# Altium project Khayyam_Board.PrjPcb
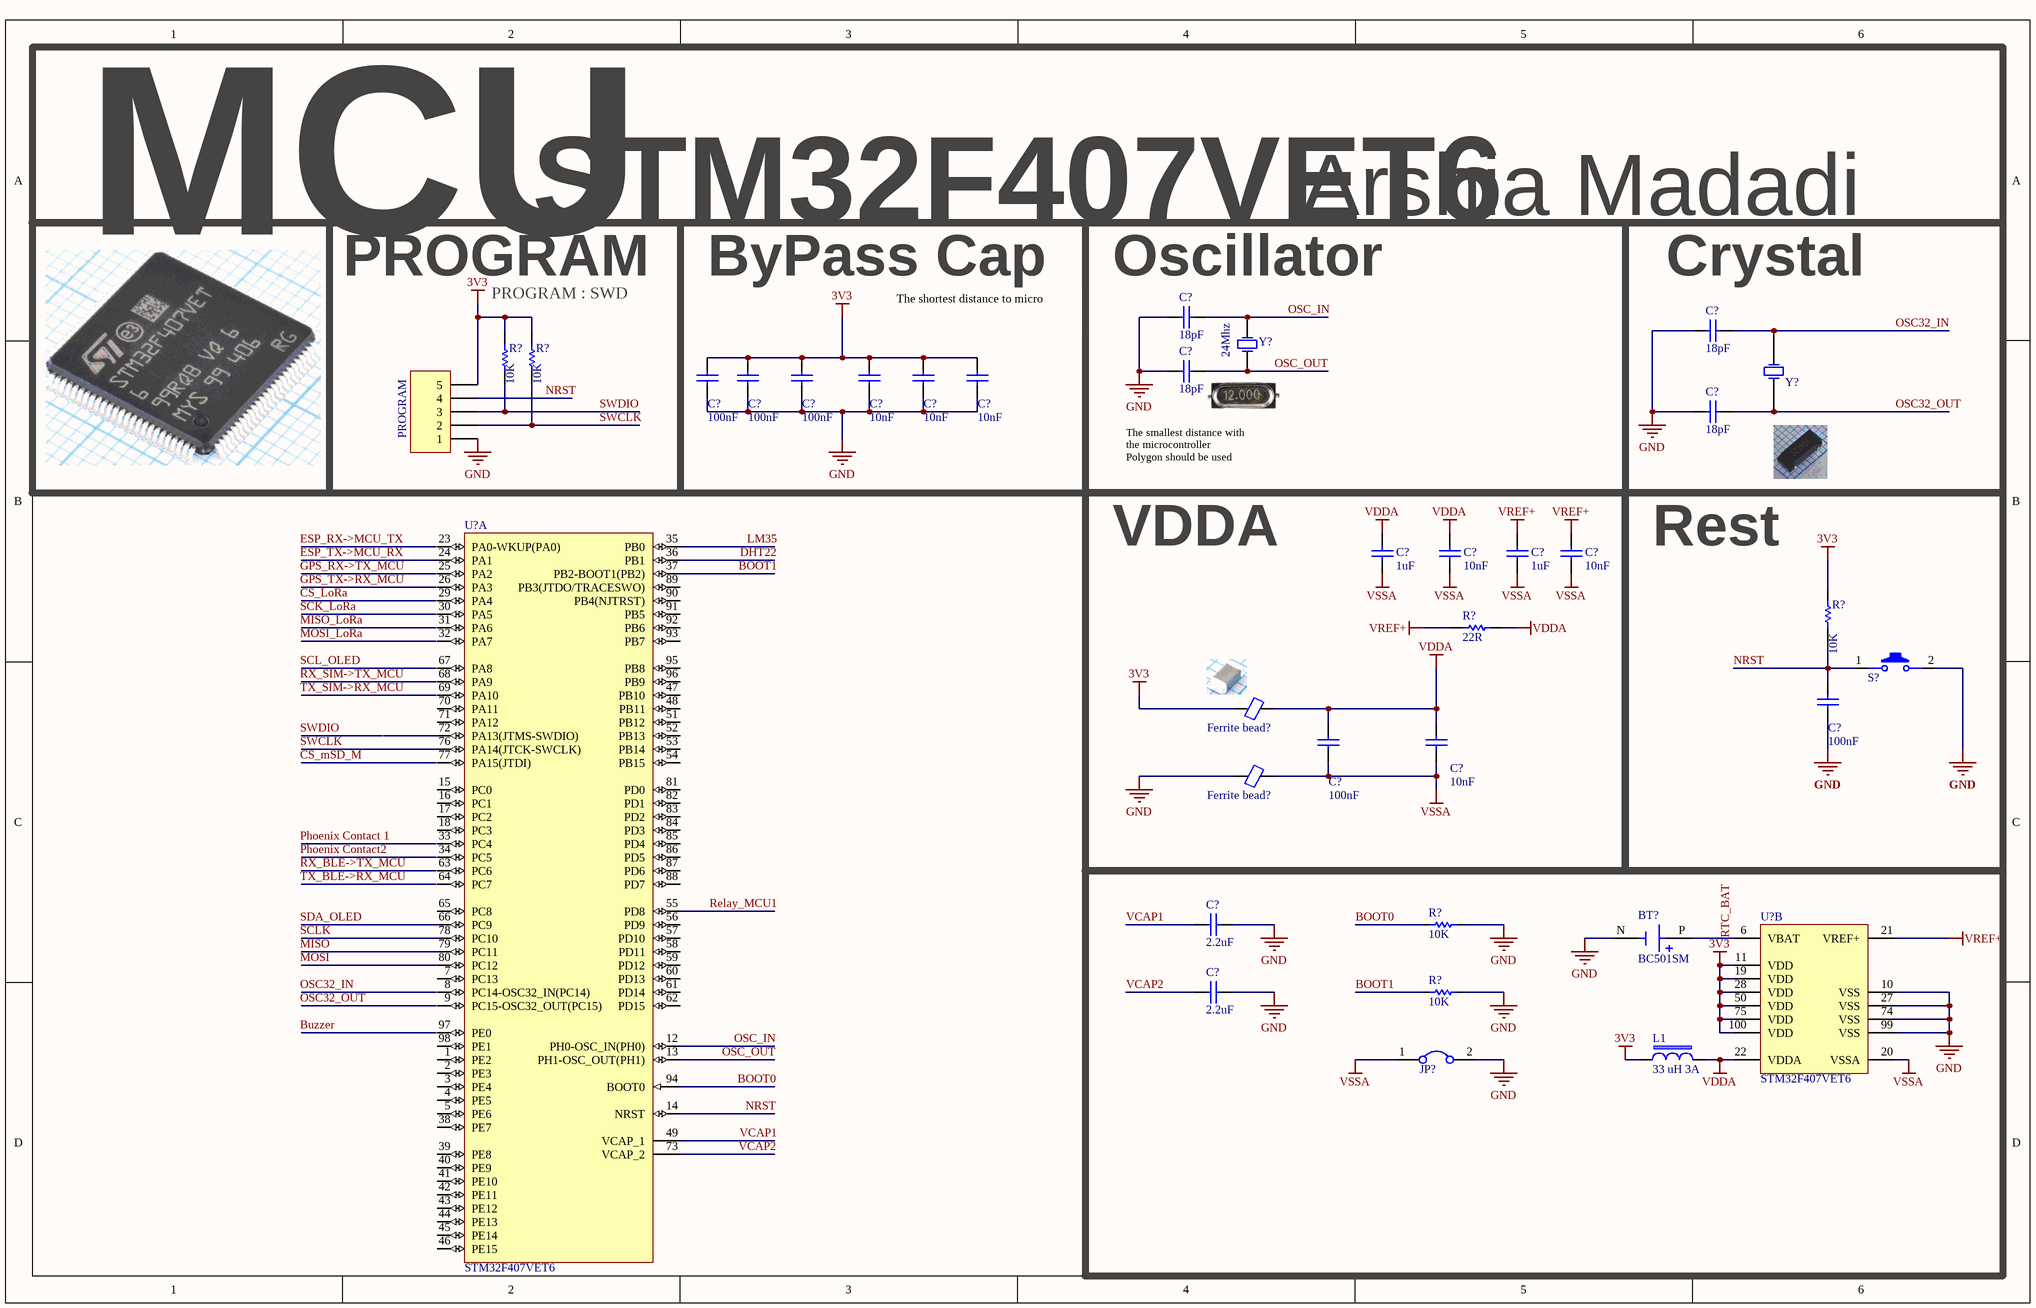
[diagram p0: MCU_stm32f407vet6.SchDoc]
5 sheets, 127 parts. Net scope: global (net labels, ports and power ports of the same name join across sheets).
Sheets:
  MCU_stm32f407vet6.SchDoc
  Power.SchDoc
  UI.SchDoc
  Communication.SchDoc
  Sensor.SchDoc

## Sheet MCU_stm32f407vet6.SchDoc
size 381 x 241 mm; SheetNumber: 1; SheetTotal: 5

### Parts
(Parts that share a designator on the sheet are numbered #1, #2 ... from top to bottom, then left to right.)
BT?  BC501SM  [BAT_BC501SM]
C?#1  18pF  [MY_CAP_SMD_0603]
C?#2  18pF  [MY_CAP_SMD_0603]
C?#3  18pF  [MY_CAP_SMD_0603]
C?#4  100nF  [MY_CAP_SMD_0603]
C?#5  100nF  [MY_CAP_SMD_0603]
C?#6  100nF  [MY_CAP_SMD_0603]
C?#7  10nF  [MY_CAP_SMD_0603]
C?#8  10nF  [MY_CAP_SMD_0603]
C?#9  10nF  [MY_CAP_SMD_0603]
C?#10  18pF  [MY_CAP_SMD_0603]
C?#11  1uF  [MY_CAP_SMD_0603]
C?#12  10nF  [MY_CAP_SMD_0603]
C?#13  1uF  [MY_CAP_SMD_0603]
C?#14  10nF  [MY_CAP_SMD_0603]
C?#15  100nF  [MY_CAP_SMD_0603]
C?#16  100nF  [MY_CAP_SMD_0603]
C?#17  10nF  [MY_CAP_SMD_0603]
C?#18  2.2uF  [MY_CAP_SMD_0603]
C?#19  2.2uF  [MY_CAP_SMD_0603]
Ferrite_bead?#1  Ferrite Bead SMD  [FB1206]  (value not drawn)
Ferrite_bead?#2  Ferrite Bead SMD  [FB1206]  (value not drawn)
JP?#1  Jumper  [Jumper Small - 2.54 - GRAY]  (value not drawn)
L1  33 uH 3A  [10UH]
PROGRAM  Header 5  [My_1X05]  (value not drawn)
R?#1  10K  [RESC3413X04N]
R?#2  10K  [RESC3413X04N]
R?#3  10K  [RESC3413X04N]
R?#4  22R  [RESC3413X04N]
R?#5  10K  [0805]
R?#6  10K  [0805]
S?#1  SW_PB2  [SMD_ALPS_SKQMBBE010]  (value not drawn)
U?#1  STM32F407VET6  [STM-LQFP100_N]  (part A of 2)
U?#2  STM32F407VET6  [STM-LQFP100_N]  (part B of 2)
Y?#1  24Mhz  [Crystal]
Y?#2  11.0592 MHz  [XTAL RTC - V]  (value not drawn)

### Blocks framed on the sheet
MCU: C?#1-C?#10 PROGRAM R?#1 R?#2 Y?#1 Y?#2
VDDA: C?#11-C?#14 C?#16 C?#17 Ferrite_bead?#1 Ferrite_bead?#2 R?#4
Rest: C?#15 R?#3 S?#1

### Nets
3V3: C?#4.1 C?#5.1 C?#6.1 C?#7.1 C?#8.1 C?#9.1 Ferrite_bead?#1.1 L1.2 PROGRAM.5 R?#1.2 R?#2.2 R?#3.2 U?#2.11(VDD) U?#2.19(VDD) U?#2.28(VDD) U?#2.50(VDD) U?#2.75(VDD) U?#2.100(VDD)
GND: BT?.N(NEG) C?#1.1 C?#2.1 C?#3.1 C?#4.2 C?#5.2 C?#6.2 C?#7.2 C?#8.2 C?#9.2 C?#10.1 C?#15.2 C?#18.2 C?#19.2 Ferrite_bead?#2.1 JP?#1.2 PROGRAM.1 R?#5.2 R?#6.2 S?#1.2 U?#2.10(VSS) U?#2.27(VSS) U?#2.74(VSS) U?#2.99(VSS)
VDDA: C?#11.1 C?#12.1 C?#16.1 C?#17.1 Ferrite_bead?#1.2 L1.1 R?#4.2 U?#2.22(VDDA)
VREF+: C?#13.1 C?#14.1 R?#4.1 U?#2.21(VREF+)
VSSA: C?#11.2 C?#12.2 C?#13.2 C?#14.2 C?#16.2 C?#17.2 Ferrite_bead?#2.2 JP?#1.1 U?#2.20(VSSA)
BOOT0: R?#5.1 U?#1.94(BOOT0)
BOOT1: R?#6.1 U?#1.37(PB2-BOOT1(PB2))
DHT22: U?#1.36(PB1)
LM35: U?#1.35(PB0)
NRST: C?#15.1 PROGRAM.4 R?#3.1 S?#1.1(Button) U?#1.14(NRST)
OSC32_IN: C?#2.2 Y?#2.2(OSC2)
OSC32_OUT: C?#10.2 Y?#2.1(OSC1)
OSC_IN: C?#1.2 U?#1.12(PH0-OSC_IN(PH0)) Y?#1.2(OSC2)
OSC_OUT: C?#3.2 U?#1.13(PH1-OSC_OUT(PH1)) Y?#1.1(OSC1)
Relay_MCU1: U?#1.55(PD8)
RTC_BAT: BT?.P(POS) U?#2.6(VBAT)
SWCLK: PROGRAM.2 R?#2.1
SWDIO: PROGRAM.3 R?#1.1
VCAP1: C?#18.1 U?#1.49(VCAP_1)
VCAP2: C?#19.1 U?#1.73(VCAP_2)

Not connected (* = marked no-connect by the designer): U?#1 1(PE2) 2(PE3) 3(PE4) 4(PE5) 5(PE6) 7(PC13) 8(PC14-OSC32_IN(PC14)) 9(PC15-OSC32_OUT(PC15)) 15(PC0) 16(PC1) 17(PC2) 18(PC3) 23(PA0-WKUP(PA0)) 24(PA1) 25(PA2) 26(PA3) 29(PA4) 30(PA5) 31(PA6) 32(PA7) 33(PC4) 34(PC5) 38(PE7) 39(PE8) 40(PE9) 41(PE10) 42(PE11) 43(PE12) 44(PE13) 45(PE14) 46(PE15) 47(PB10) 48(PB11) 51(PB12) 52(PB13) 53(PB14) 54(PB15) 56(PD9) 57(PD10) 58(PD11) 59(PD12) 60(PD13) 61(PD14) 62(PD15) 63(PC6) 64(PC7) 65(PC8) 66(PC9) 67(PA8) 68(PA9) 69(PA10) 70(PA11) 71(PA12) 72(PA13(JTMS-SWDIO)) 76(PA14(JTCK-SWCLK)) 77(PA15(JTDI)) 78(PC10) 79(PC11) 80(PC12) 81(PD0) 82(PD1) 83(PD2) 84(PD3) 85(PD4) 86(PD5) 87(PD6) 88(PD7) 89(PB3(JTDO/TRACESWO)) 90(PB4(NJTRST)) 91(PB5) 92(PB6) 93(PB7) 95(PB8) 96(PB9) 97(PE0) 98(PE1)

### Notes on the sheet
- STM32F407VET6
- Arshia Madadi
- PROGRAM
- (near R?#2) PROGRAM : SWD
- ByPass Cap
- (near C?#1) Oscillator
- (near C?#2) Crystal
- (near C?#8) The shortest distance to micro
- The smallest distance with the microcontroller
  Polygon should be used
- Labels drawn without touching a wire or pin: Buzzer, CS_LoRa, CS_mSD_M, ESP_RX->MCU_TX, ESP_TX->MCU_RX, GPS_RX->TX_MCU, GPS_TX->RX_MCU, MISO, MISO_LoRa, MOSI, MOSI_LoRa, OSC32_IN, OSC32_OUT, Phoenix Contact2, Phoenix Contact 1, RX_BLE->TX_MCU, RX_SIM->TX_MCU, SCK_LoRa, SCL_OLED, SCLK, SDA_OLED, SWCLK, SWDIO, TX_BLE->RX_MCU, TX_SIM->RX_MCU

### Library data of the parts
BT? = BC501SM: BATTERY HOLDER COIN 12MM SMD; MF: MPD; SnapEDA_Link: https://www.snapeda.com/parts/BC501SM/MPD/view-part/?ref=snap; Package: None; MP: BC501SM; Price: None; Availability: Unavailable; Check_prices: https://www.snapeda.com/parts/BC501SM/MPD/view-part/?ref=eda; Value: *
C?#1-C?#19 = CAP SMD_0603
Ferrite_bead?#1 Ferrite_bead?#2 = Ferrite Bead SMD Package: Designer: Ali Hafizi
JP?#1 = Jumper: Company: E.P.I.L; Defualt State: Close; Design Date: 2011/11/02
L1 = Inductor_B: Inductor; Code_IEC: 1005; Published: 8-Jun-2000; LatestRevisionDate: 17-Jul-2002; LatestRevisionNote: Re-released for DXP Platform.; PackageReference: 0402-A; Publisher: Altium Limited; Code_JEITA: 0402
PROGRAM = Header 5: Header, 5-Pin; LatestRevisionDate: 17-Jul-2002; LatestRevisionNote: Re-released for DXP Platform.; Publisher: Altium Limited
R?#1-R?#4 = RES 0805 0.125W: RES 0805; Designer: Abbas Basereh; Desc.: RES SMD 0805; Data: 16-12-2016
R?#5 R?#6 = Res: Resistor; Published: 8-Jun-2000; LatestRevisionDate: 17-Jul-2002; LatestRevisionNote: Re-released for DXP Platform.; PackageReference: AXIAL-0.3; Publisher: Altium Limited
S?#1 = SW_PB2: 2 Pin Push Button Switch; Company: SJ Libraries; Designer: Eng. Saeid Jorablo; Mounting Technology: Surface Mount\Through-Hole; ComponentLink1Description: Datasheet; Pin Count: 0; Update Date: 6/3/2012; Category: MISC; HelpURL: http://s3.picofile.com/file/7443264187/Coming_Soon_logo.gif
U?#1 U?#2 = STM32F407VET6: ARM Cortex-M4 32-bit MCU+FPU, 210 DMIPS, 512 kB Flash, 192 kB Internal RAM, 82 I/Os, 100-pin LQFP, -40 to 85 degC, Tray; Manufacturer: STMicroelectronics; D/A Converter: 2x12-bit; FLASH Size (Prog) (kB): 512; I/Os (High Current): 82; Internal RAM Size (kB): 192; Operating Frequency(F) (Processor speed) (MHz): 168; Supply Voltage(Vcc) max (V): 3.6; Supply Voltage(Vcc) min (V): 1.8; DatasheetVersion: Rev. 4; PackageVersion: Rev. 1, 06/2013; PackageReference: LQFP100; PackageDescription: 100-Pin Low Profile Quad Flat Package, 14 x 14 mm Body, 0.5 mm Pitch; Supplier 1: Digi-Key; Supplier Part Number 1: 497-12075-ND; Supplier 2: Farnell; Supplier Part Number 2: 2064367; Supplier 3: Newark; Supplier Part Number 3: 73T2332; Supplier 4: Mouser; Supplier Part Number 4: 511-STM32F407VET6; Core: ARM Cortex-M4; Packing: Tray; Mounting Technology: Surface Mount; PartNumber: STM32F407VET6; ComponentLink1Description: Manufacturer URL; ComponentLink1URL: http://www.st.com/web/en/home.html; ComponentLink2Description: Datasheet; ComponentLink2URL: http://www.st.com/st-web-ui/static/active/en/resource/technical/document/datasheet/DM00037051.pdf; ComponentLink3Description: Package Specification; ComponentLink3URL: http://www.st.com/st-web-ui/static/active/en/resource/technical/document/data_brief/DM00071938.pdf
Y?#1 = XTAL: Crystal Oscillator; Published: 8-Jun-2000; LatestRevisionDate: 17-Jul-2002; LatestRevisionNote: Re-released for DXP Platform.; PackageReference: R38; Publisher: Altium Limited
Y?#2 = XTAL_Crystal: XTAL Crystal; Company: SJ Libraries; Designer: Eng. Saeid Jorablo; Design Date: 11/04/2011; ComponentLink1Description: Datasheet; ComponentLink2Description: Reference; Publisher: SJ Unlimited; Mounting Technology: Surface Mount\Through-Hole; Value: 11.0592 MHz; HelpURL: http://s3.picofile.com/file/7443264187/Coming_Soon_logo.gif; Status: Unreleased

## Sheet Power.SchDoc
size 381 x 241 mm; SheetNumber: 1; SheetTotal: 5
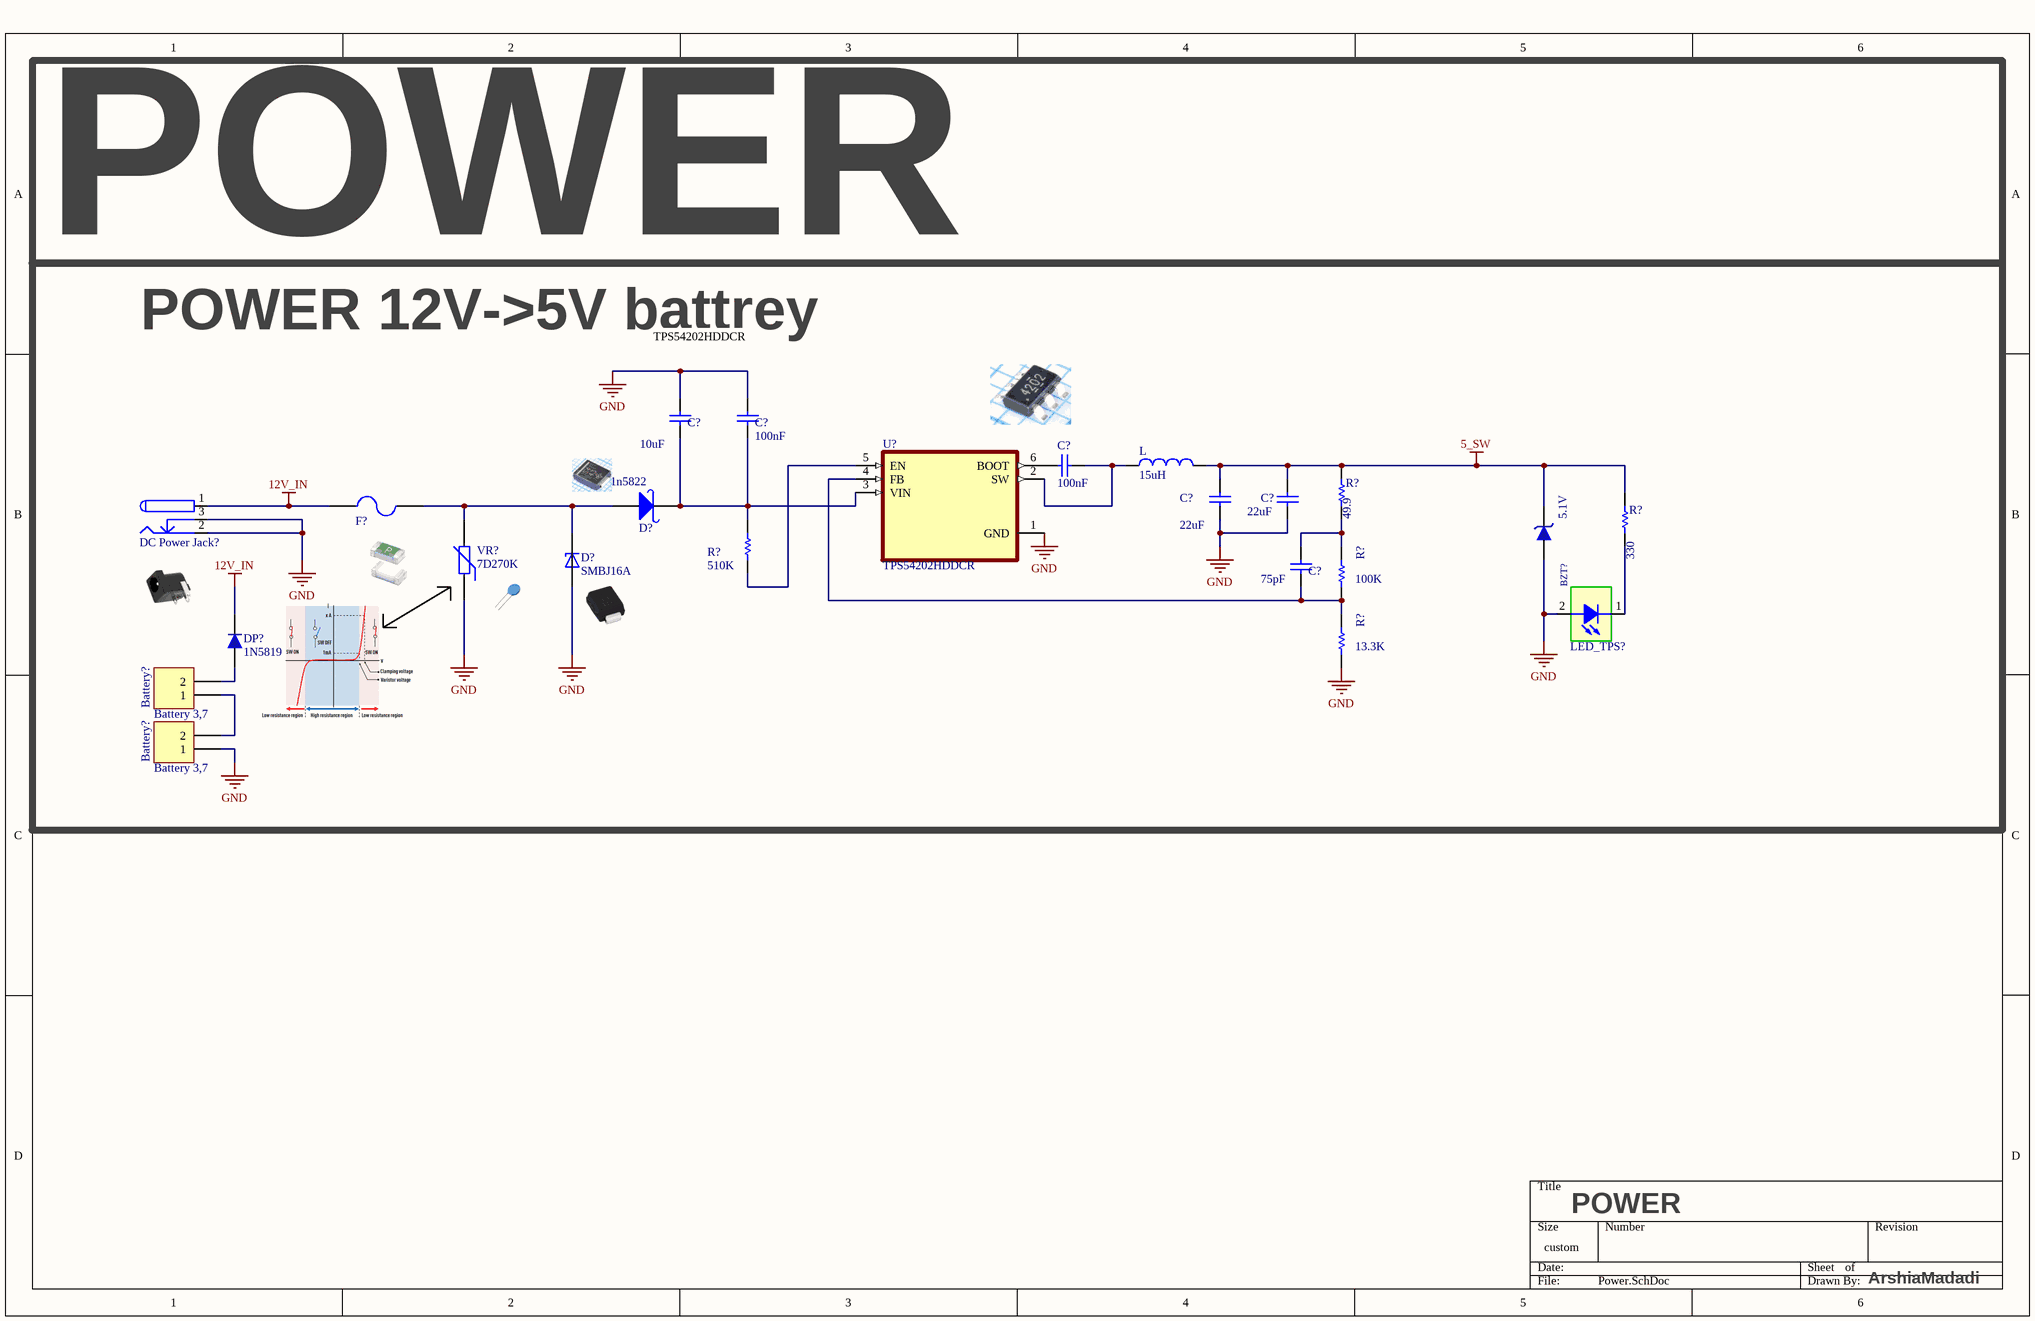
[diagram p1: Power.SchDoc]

### Parts
(Parts that share a designator on the sheet are numbered #1, #2 ... from top to bottom, then left to right.)
Battery?#1  Battery 3,7  [HDR1X2]
Battery?#2  Battery 3,7  [HDR1X2]
BZT?  5.1V  [SOD123]
C?#20  10uF  [MY_CAP_SMD_0603]
C?#21  100nF  [MY_CAP_SMD_0603]
C?#22  100nF  [MY_CAP_SMD_0603]
C?#23  22uF  [MY_CAP_SMD_0603]
C?#24  22uF  [MY_CAP_SMD_0603]
C?#25  75pF  [MY_CAP_SMD_0603]
D?#1  1n5822  [DO-214AB(SMC)]
D?#2  SMBJ16A  [DIOM4336X265N]
DC_Power_Jack?  DC Power Jack  [DC Power Jack 1]  (value not drawn)
DP?#1  1N5819  [1n58XX DO-201AD]
F?  F=3.0 A  [1206 FUSE]  (value not drawn)
L  15uH  [IND0805]
LED_TPS?  SMD 1206 LED  [LED 1206]  (value not drawn)
R?#7  49.9  [RESC3413X04N]
R?#8  330  [RESC3413X04N]
R?#9  510K  [RESC3413X04N]
R?#10  100K  [RESC3413X04N]
R?#11  13.3K  [RESC3413X04N]
U?#3  TPS54202HDDCR  [SOT95P280X110-6N]
VR?  7D270K  [07D XXX]

### Nets
5_SW: BZT?.2 C?#23.1 C?#24.1 L.2 R?#7.2 R?#8.2
12V_IN: DC_Power_Jack?.1 DP?#1.2 F?.1
GND: Battery?#2.1 BZT?.1 C?#20.1 C?#21.1 C?#23.2 C?#24.2 D?#2.A DC_Power_Jack?.2 DC_Power_Jack?.3 LED_TPS?.2 R?#11.2 U?#3.1(GND) VR?.1
NetBattery?#1_1: Battery?#1.1 Battery?#2.2
NetBattery?#1_2: Battery?#1.2 DP?#1.1
NetC?#20_2: C?#20.2 C?#21.2 D?#1.2(K) R?#9.1 U?#3.3(VIN)
NetC?#22_1: C?#22.1 U?#3.6(BOOT)
NetC?#22_2: C?#22.2 L.1 U?#3.2(SW)
NetC?#25_1: C?#25.1 R?#7.1 R?#10.1
NetC?#25_2: C?#25.2 R?#10.2 R?#11.1 U?#3.4(FB)
NetD?#1_1: D?#1.1(A) D?#2.C F?.2 VR?.2
NetLED_TPS?_1: LED_TPS?.1 R?#8.1
NetR?#9_2: R?#9.2 U?#3.5(EN)

### Notes on the sheet
- POWER
- POWER 12V->5V battrey
- TPS54202HDDCR
- ArshiaMadadi

### Library data of the parts
Battery?#1 Battery?#2 = Header 2: Header, 2-Pin; LatestRevisionDate: 17-Jul-2002; LatestRevisionNote: Re-released for DXP Platform.; Publisher: Altium Limited
BZT? = ZENER GENERAL DIODE: DIODE ZENER GENERAL; VALUE: 12V; Published: 2017-1-12; PackageVersion: 2017-1-12; PackageReference: DO 35; Publisher: Abbas Basereh; PackageDescription: DIODE GEN ZENER; ComponentLink1Description: Manufacturer Link; ComponentLink2Description: Datasheet
C?#20-C?#25 = CAP SMD_0603
D?#1 = 1N5822 SMD: Schottky Rectifiers; Part. No: SS34; Manufacturer: ON Semiconductor/Fairchild; Designer: Abbas Basereh; Link: https://www.aliexpress.com/item/Free-shipping-100pcs-1n5822-sma-smd-do-214ac-Schottky-diode-ss34/32337482329.html?spm=2114.01010208.3.1.zLZDsP&ws_ab_test=searchweb0_0,searchweb201602_4_10065_10068_10084_10083_10080_10082_10081_10060_10061_10062_10056_10055_10054_10059_10099_10078_10079_427_10073_10103_10102_10096_10052_10050_10051,searchweb201603_4&btsid=6e50dc92-ac69-45bc-a19e-209af19ce602; Link: http://www.tme.eu/en/details/ss34/smd-schottky-diodes/vishay/ss34-e357t/; Link: http://www.digikey.com/product-detail/en/on-semiconductor-fairchild/SS34/SS34FSCT-ND/2094459; Data: 16-12-2016
D?#2 = SMBJ16A: 600W, 18.8V, 5%, Unidirectional, TVS; MF: Taiwan Semiconductor; MP: SMBJ16A; SnapEDA_Link: https://www.snapeda.com/parts/SMBJ16A/Taiwan+Semiconductor/view-part/?ref=snap; Check_prices: https://www.snapeda.com/parts/SMBJ16A/Taiwan+Semiconductor/view-part/?ref=eda; Price: None; Availability: In Stock; Purchase-URL: https://pricing.snapeda.com/search/part/SMBJ16A/?ref=eda; Package: SMD-2-2 Avago; Value: *
DC_Power_Jack? = DC Power Jack: DC Power Jack. Center Pin 2.5mm. Diameter: 5.7mm; Designer: Ali Hafizi; Company: Personal; Project Name: Laser; Adding Date: 10/21/2009
DP?#1 = 1N5819: Schottkey Rectifiers; Designer: Abbas Basereh; Data: 16-12-2016; Link: *; Part. No: *
F? = Fuse SMD1206: SMD Fuses 1206; Designer: Abbas Basereh; Desc.: SMD Fuses 1206; Data: 16-12-2016
L = INDUCTOR SMD PACKAGE: TOTAL INDUCTOR SMD PACK; Designer: Abbas Basereh; Desc.: INDUCTOR  SMD TOTAL PACKAGES; VALUE: 1u; Data: 2017-3-10
LED_TPS? = LED SMD 1206
R?#7-R?#11 = RES 0805 0.125W: as R?#1 on sheet MCU_stm32f407vet6; Data: 16-12-2016
U?#3 = TPS54202HDDCR: 4.5V to 28V Input, 2A Output, Synchronous Step-Down Voltage Converter 6-SOT-23-THIN -40 to 125; MF: Texas Instruments; MP: TPS54202HDDCR; Price: None; Availability: Good; Check_prices: https://www.snapeda.com/parts/TPS54202HDDCR/Texas%20Instruments/view-part/573706/?ref=eda; Package: SOT-23-THN-6 Texas Instruments; Purchase-URL: https://pricing.snapeda.com/search/part/TPS54202HDDCR/?ref=eda; SnapEDA_Link: https://www.snapeda.com/parts/TPS54202HDDCR/Texas%20Instruments/view-part/573706/?ref=snap; Value: *
VR? = VARISTOR (VDR): VARISTORS; Manufacturer: china-canada-philipina; Designer: Abbas Basereh; VALUE: xxDxxx; Models: MOV-VDR-COV; Data: 2017-1-5; Link: digikey.com; PUBLISHER: ABBAS BASEREH

## Sheet UI.SchDoc
size A4; SheetNumber: 3; SheetTotal: 4
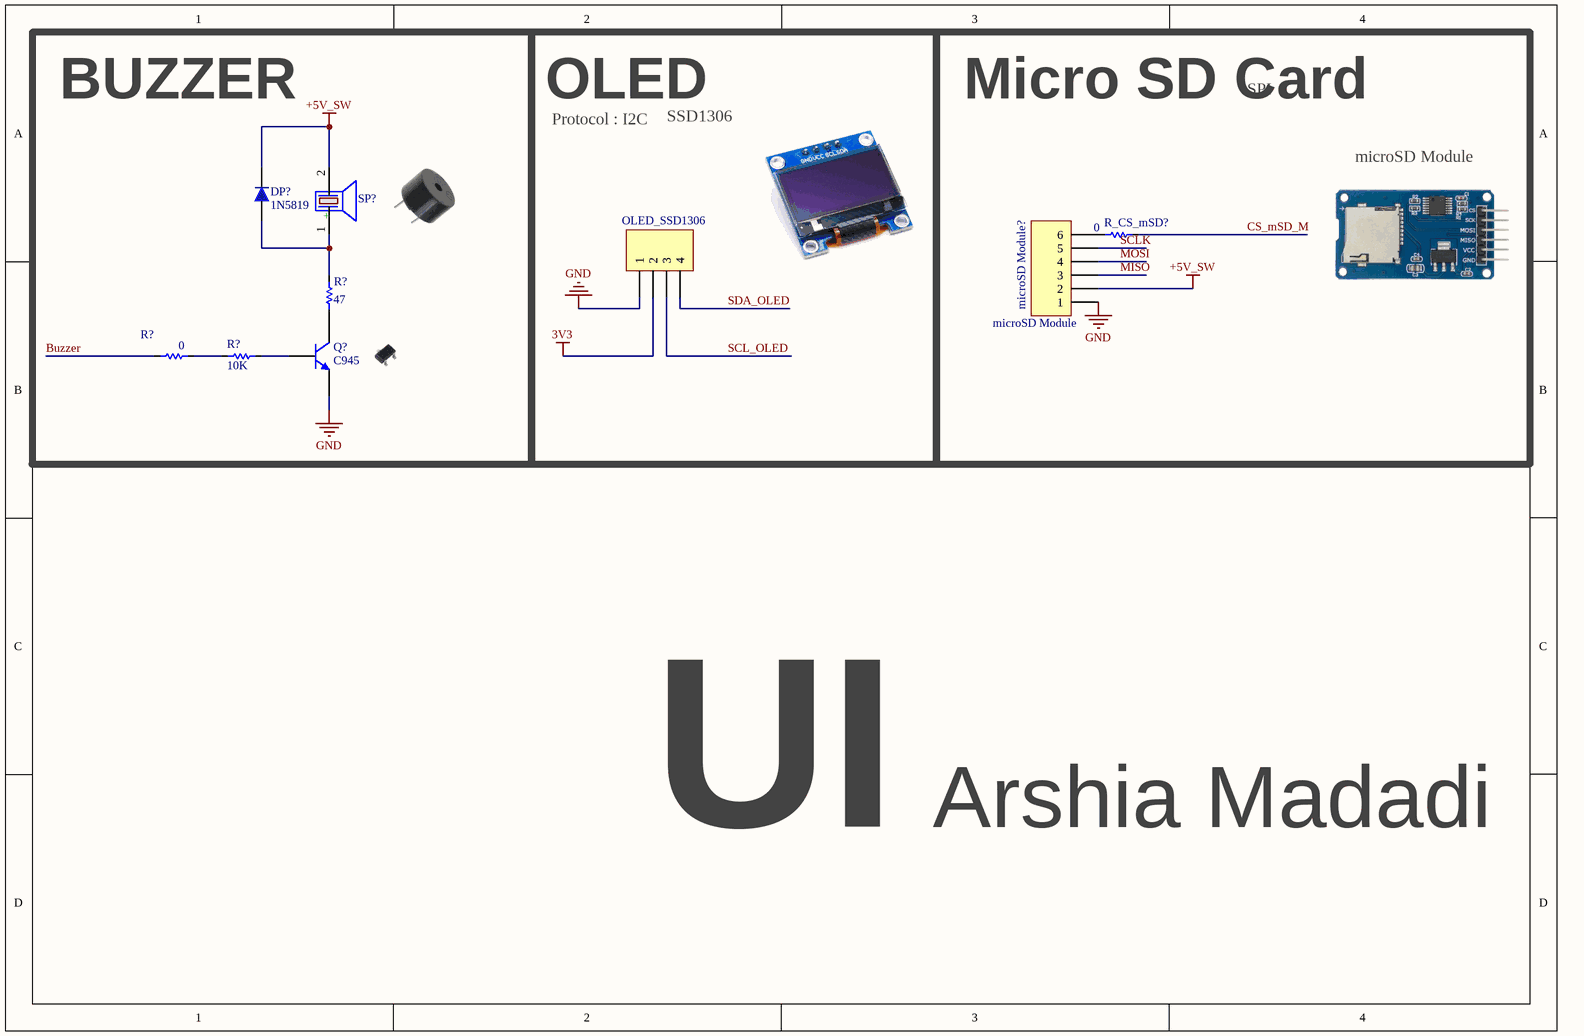
[diagram p2: UI.SchDoc]

### Parts
(Parts that share a designator on the sheet are numbered #1, #2 ... from top to bottom, then left to right.)
DP?#2  1N5819  [430X270D]
microSD_Module?  microSD Module  [HDR1X6-1]
OLED_SSD1306  Header 4  [My_1X04]  (value not drawn)
Q?#1  C945  [SOT23_M]
R?#12  47  [0603]
R?#13  0  [0603]
R?#14  10K  [0603]
R_CS_mSD?  0  [0603]
SP?  (no value)  [BUZZER 7.62mm DC]

### Blocks framed on the sheet
BUZZER: DP?#2 Q?#1 R?#12-R?#14 SP?
OLED: OLED_SSD1306
Micro SD Card: microSD_Module? R_CS_mSD?

### Nets
3V3: OLED_SSD1306.2
+5V_SW: DP?#2.2 microSD_Module?.2 SP?.2(-)
GND: microSD_Module?.1 OLED_SSD1306.1 Q?#1.2(E)
Buzzer: R?#13.2
CS_mSD_M: R_CS_mSD?.1
MISO: microSD_Module?.3
MOSI: microSD_Module?.4
SCL_OLED: OLED_SSD1306.3
SCLK: microSD_Module?.5
SDA_OLED: OLED_SSD1306.4
NetDP?#2_1: DP?#2.1 R?#12.2 SP?.1(+)
NetmicroSD_Module?_6: microSD_Module?.6 R_CS_mSD?.2
NetQ?#1_1: Q?#1.1(B) R?#14.1
NetQ?#1_3: Q?#1.3(C) R?#12.1
NetR?#13_1: R?#13.1 R?#14.2

### Notes on the sheet
- SPI
- Protocol : I2C
- SSD1306
- microSD Module
- Arshia Madadi
- UI

### Library data of the parts
DP?#2 = 1N5819: as DP?#1 on sheet Power; Data: 16-12-2016; Link: *; Part. No: *
microSD_Module? = Header 6: Header, 6-Pin; LatestRevisionDate: 17-Jul-2002; LatestRevisionNote: Re-released for DXP Platform.; Publisher: Altium Limited
OLED_SSD1306 = Header 4: Header, 4-Pin; LatestRevisionDate: 17-Jul-2002; LatestRevisionNote: Re-released for DXP Platform.; Publisher: Altium Limited
Q?#1 = C945: NPN Silicon Epitaxial Planar Transistor; Published: 2017-2-8; LatestRevisionDate: 2017; LatestRevisionNote: IPC-7351 Footprint Added.; DatasheetVersion: 2017; PackageVersion: 2017-2-8; PackageReference: SOT23; Publisher: Abbas Basereh; PackageDescription: 3-Pin SOT-23 Package 0.95 mm Pitch, 2.3 mm Lead Span; ComponentLink1Description: Manufacturer Link; ComponentLink1URL: http://www.taitroncomponents.com/; ComponentLink2Description: Datasheet; ComponentLink2URL: http://www.taitroncomponents.com/
R?#12-R?#14 R_CS_mSD? = Res: Resistor; Published: 8-Jun-2000; LatestRevisionDate: 17-Jul-2002; LatestRevisionNote: Re-released for DXP Platform.; PackageReference: AXIAL-0.3; Publisher: Altium Limited
SP? = PIEZO BUZZER: PIEZO BUZZER ACTIVE; Designer: Abbas Basereh; Comment_1: SPEAKER AND BEEP; Design Date: 1395/11/14; ComponentLink2Description: Reference; PackageDescription: THD; Publisher: Abbas Basereh; Mounting Technology: THD; Pin Count: 2; Status: Unreleased

## Sheet Communication.SchDoc
size A3; SheetNumber: 3; SheetTotal: 4
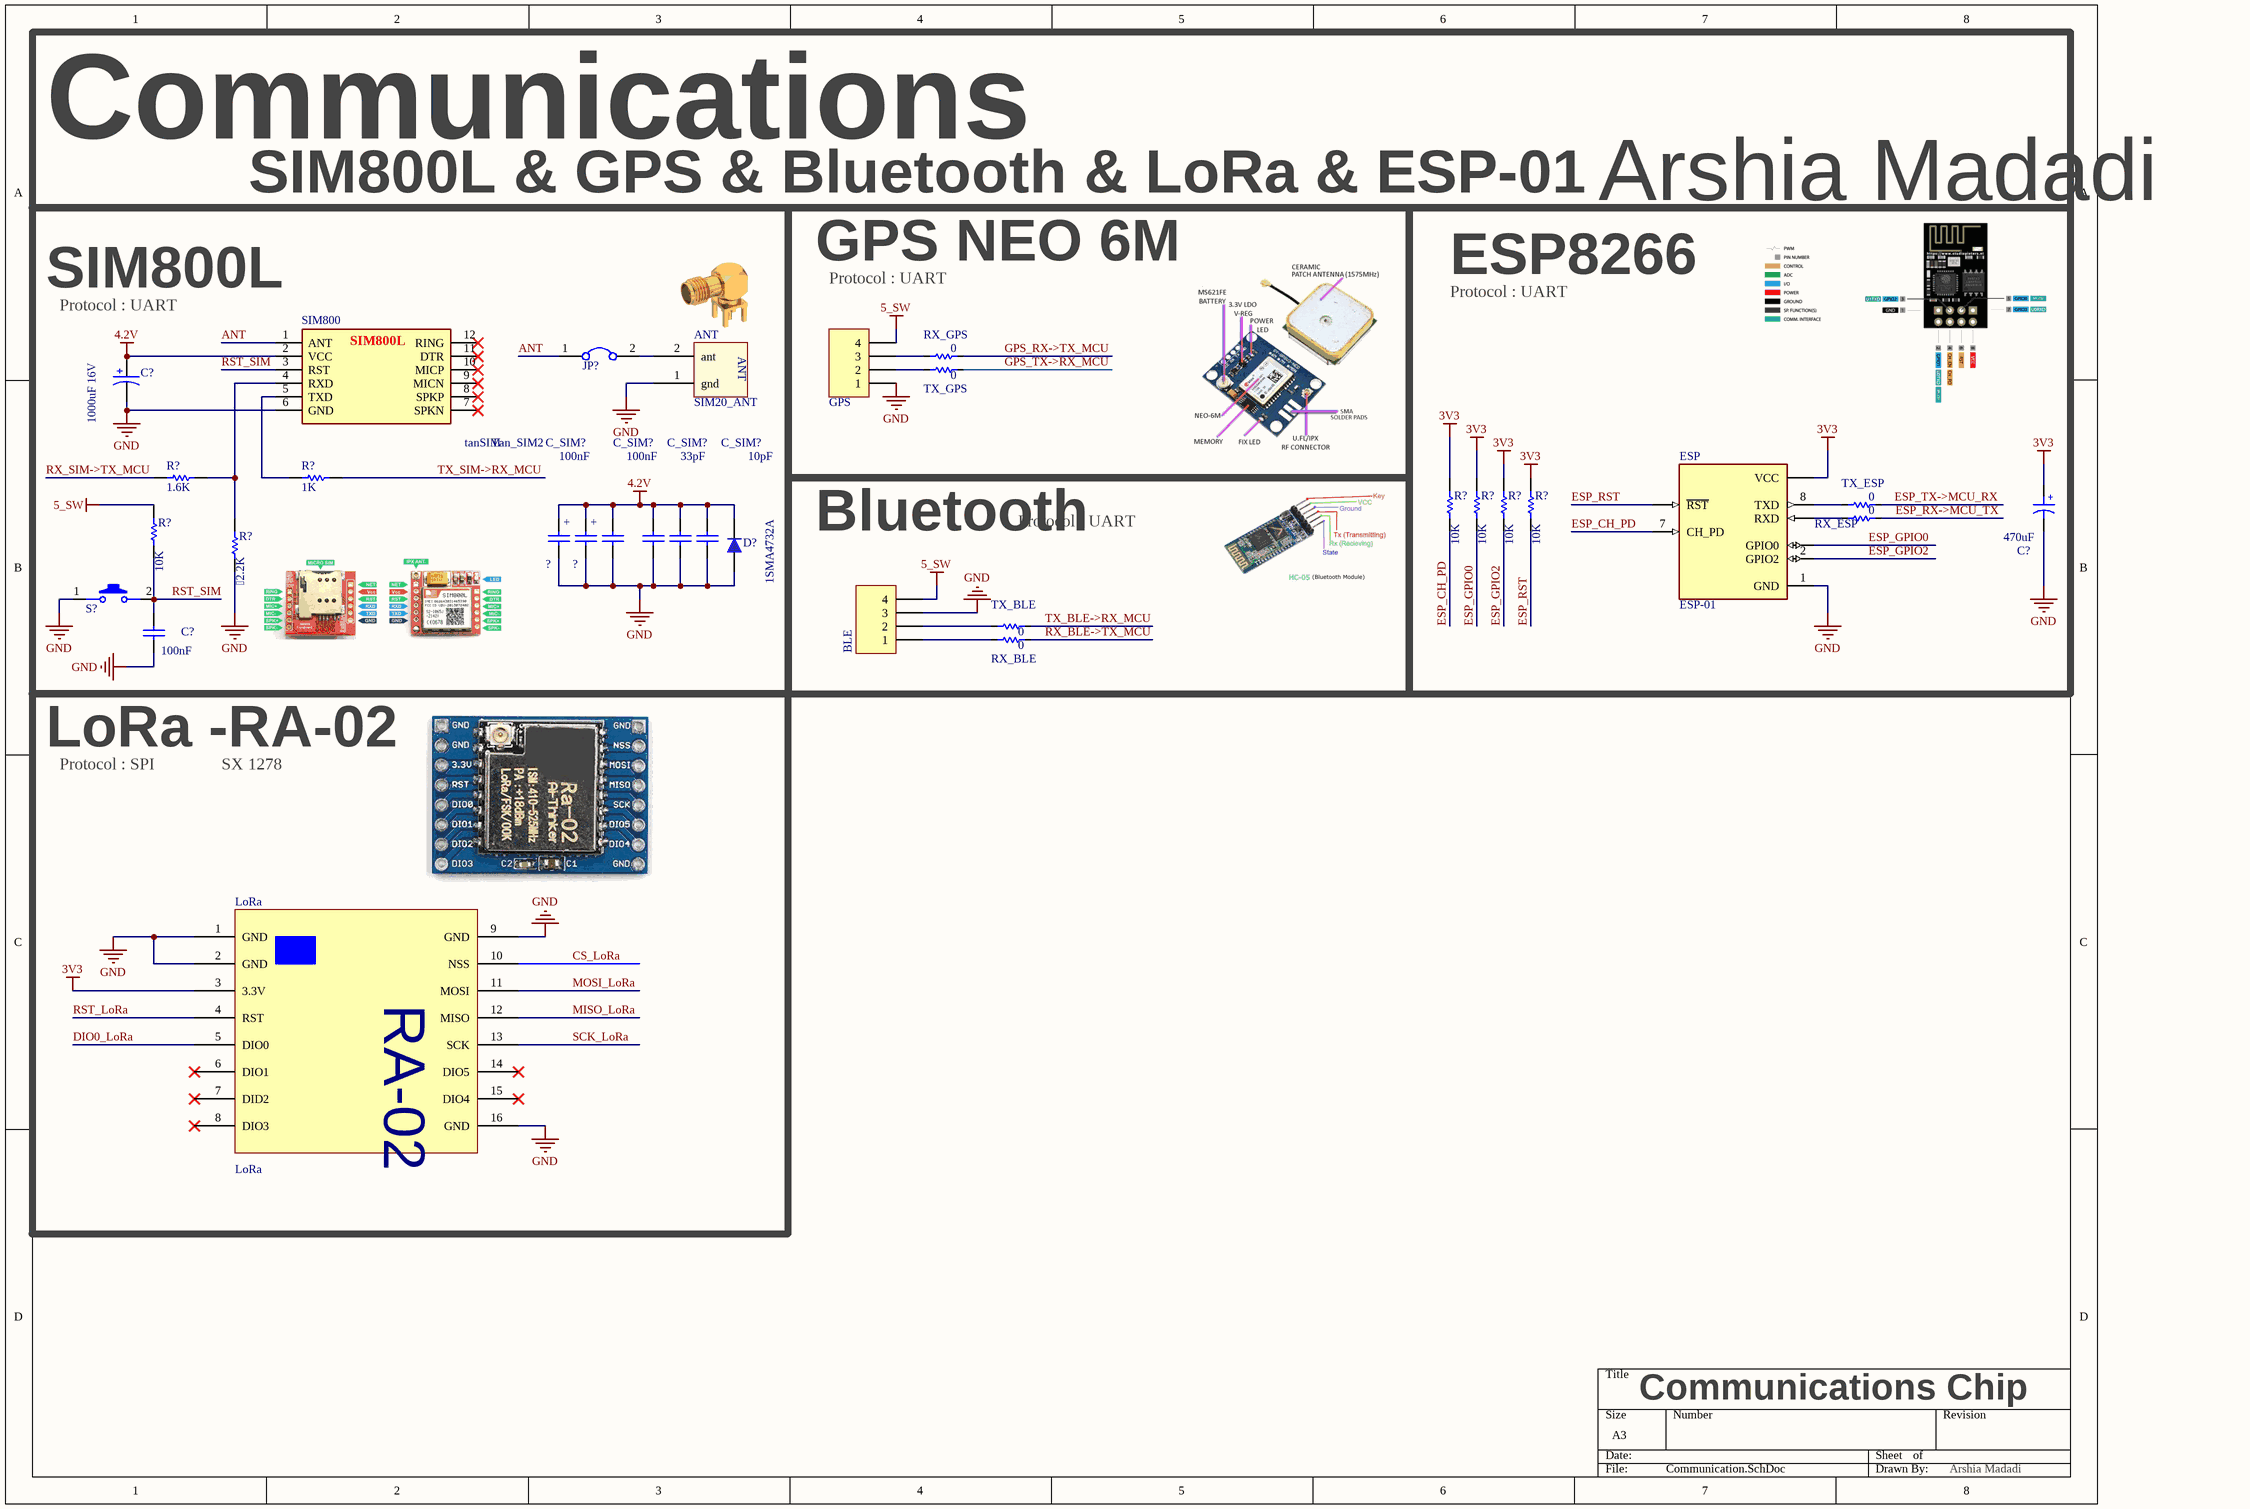
[diagram p3: Communication.SchDoc]

### Parts
(Parts that share a designator on the sheet are numbered #1, #2 ... from top to bottom, then left to right.)
?#1  tanSIM  [MY_CAP_SMD-C]
?#2  Tan_SIM2  [MY_CAP_SMD-C]
ANT  SIM20_ANT  [MY_SIM20_ANT]
BLE  Header 4  [My_1X04]  (value not drawn)
C?#26  1000uF 16V  [SMD_1000uf 16V]
C?#27  470uF  [CAP SMD 470uF]
C?#28  100nF  [MY_CAP_SMD_0603]
C_SIM?#1  100nF  [CAP1206]
C_SIM?#2  100nF  [CAP1206]
C_SIM?#3  33pF  [CAP1206]
C_SIM?#4  10pF  [CAP1206]
D?#3  1SMA4732A  [SMA DIODE 2]
ESP  ESP-01  [MODULE_ESP-01]
GPS  Header 4  [My_1X04]  (value not drawn)
JP?#2  Jumper  [Jumper Small - 2.54 - GRAY]  (value not drawn)
LoRa  LoRa  [PCBComponent_1]
R?#15  1.6K  [RESC3413X04N]
R?#16  1K  [RESC3413X04N]
R?#17  10K  [RESC3413X04N]
R?#18  10K  [RESC3413X04N]
R?#19  10K  [RESC3413X04N]
R?#20  10K  [RESC3413X04N]
R?#21  10K  [RESC3413X04N]
R?#22  2.2K  [RESC3413X04N]
RX_BLE  0  [0603]
RX_ESP  0  [0603]
RX_GPS  0  [0603]
S?#2  SW_PB2  [SMD_ALPS_SKQMBBE010]  (value not drawn)
SIM800  (no value)  [SIM800L]
TX_BLE  0  [0603]
TX_ESP  0  [0603]
TX_GPS  0  [0603]

### Blocks framed on the sheet
SIM800L & GPS & Bluetooth & LoRa & ESP-01: ?#1 ?#2 ANT C?#26 C?#28 C_SIM?#1-C_SIM?#4 D?#3 JP?#2 R?#15 R?#16 R?#21 R?#22 S?#2 SIM800
GPS NEO 6M: GPS RX_GPS TX_GPS
Arshia Madadi: C?#27 ESP R?#17-R?#20 RX_ESP TX_ESP
Bluetooth: BLE RX_BLE TX_BLE
LoRa -RA-02: LoRa

### Nets
3V3: C?#27.1 ESP.5(VCC) LoRa.3(3.3V) R?#17.2 R?#18.2 R?#19.2 R?#20.2
4.2V: ?#1.+ ?#2.+ C?#26.1 C_SIM?#1.1 C_SIM?#2.1 C_SIM?#3.1 C_SIM?#4.1 D?#3.2 SIM800.2(VCC)
5_SW: BLE.4 GPS.4 R?#21.2
GND: ?#1.- ?#2.- ANT.1(gnd) BLE.3 C?#26.2 C?#27.2 C?#28.2 C_SIM?#1.2 C_SIM?#2.2 C_SIM?#3.2 C_SIM?#4.2 D?#3.1 ESP.1(GND) GPS.1 LoRa.1(GND) LoRa.2(GND) LoRa.9(GND) LoRa.16(GND) R?#22.1 S?#2.1(Button) SIM800.6(GND)
ANT: JP?#2.1 SIM800.1(ANT)
CS_LoRa: LoRa.10(NSS)
DIO0_LoRa: LoRa.5(DIO0)
ESP_CH_PD: ESP.7(CH_PD) R?#17.1
ESP_GPIO0: ESP.3(GPIO0) R?#18.1
ESP_GPIO2: ESP.2(GPIO2) R?#19.1
ESP_RST: ESP.6(~{RST}) R?#20.1
ESP_RX->MCU_TX: RX_ESP.2
ESP_TX->MCU_RX: TX_ESP.2
GPS_RX->TX_MCU: RX_GPS.2
GPS_TX->RX_MCU: TX_GPS.2
MISO_LoRa: LoRa.12(MISO)
MOSI_LoRa: LoRa.11(MOSI)
RST_LoRa: LoRa.4(RST)
RST_SIM: C?#28.1 R?#21.1 S?#2.2 SIM800.3(RST)
RX_BLE->TX_MCU: RX_BLE.2
RX_SIM->TX_MCU: R?#15.1
SCK_LoRa: LoRa.13(SCK)
TX_BLE->RX_MCU: TX_BLE.2
TX_SIM->RX_MCU: R?#16.2
NetANT_2: ANT.2(ant) JP?#2.2
NetBLE_1: BLE.1 RX_BLE.1
NetBLE_2: BLE.2 TX_BLE.1
NetESP_4: ESP.4(RXD) RX_ESP.1
NetESP_8: ESP.8(TXD) TX_ESP.1
NetGPS_2: GPS.2 TX_GPS.1
NetGPS_3: GPS.3 RX_GPS.1
NetR?#15_2: R?#15.2 R?#22.2 SIM800.4(RXD)
NetR?#16_1: R?#16.1 SIM800.5(TXD)

Not connected (* = marked no-connect by the designer): LoRa 6(DIO1)* 7(DID2)* 8(DIO3)* 14(DIO5)* 15(DIO4)*; SIM800 7(SPKN)* 8(SPKP)* 9(MICN)* 10(MICP)* 11(DTR)* 12(RING)*

### Notes on the sheet
- Communications
- SIM800L
- Protocol : UART
- ESP8266
- Protocol : SPI
- SX 1278
- Communications Chip
- Arshia Madadi
- (in symbol Cap ELECTROLITIC TOTAL SIZE) +
- (in symbol Capacitor) +
- (in symbol LoRa) RA-02

### Library data of the parts
?#1 ?#2 = CAP_TANTAL_C: Value: 3300u
ANT = SIM20_ANT: ANT
BLE GPS = Header 4: Header, 4-Pin; LatestRevisionDate: 17-Jul-2002; LatestRevisionNote: Re-released for DXP Platform.; Publisher: Altium Limited
C?#26 = Capacitor: Electrolyte Capacitor
C?#27 = Cap ELECTROLITIC TOTAL SIZE: Capacitor Electrical SMD; Designer: Abbas Basereh; VALUE: 1uF; Data: 16-12-2016; Part. No: *
C?#28 = CAP SMD_0603: 1.6 mm × 0.8 mm
C_SIM?#1 C_SIM?#2 = CAP SMD PACKAGE: TOTAL CAPACITOR SMD PACK; Designer: Abbas Basereh; Desc.: CAP SMD TOTAL PACKAGES; Data: 2017-3-10; VALUE: 100nF
C_SIM?#3 C_SIM?#4 = CAP SMD PACKAGE: TOTAL CAPACITOR SMD PACK; Designer: Abbas Basereh; Desc.: CAP SMD TOTAL PACKAGES; VALUE: 100nF; Data: 2017-3-10
D?#3 = Diode SMD Package: Diode SMD Pakage
ESP = ESP-01: ESP-01M ESP8266 DIP Adapter series Transceiver; 802.11 b/g/n (Wi-Fi, WiFi, WLAN) Evaluation Board; MF: AI-Thinker; SnapEDA_Link: https://www.snapeda.com/parts/ESP-01/AI-Thinker/view-part/?ref=snap; Package: Non-Standard AI-Thinker; Value: *; MP: ESP-01; Check_prices: https://www.snapeda.com/parts/ESP-01/AI-Thinker/view-part/?ref=eda
JP?#2 = Jumper: Company: E.P.I.L; Defualt State: Close; Design Date: 2011/11/02
R?#15-R?#22 = RES 0805 0.125W: as R?#1 on sheet MCU_stm32f407vet6; Data: 16-12-2016
RX_BLE RX_ESP RX_GPS TX_BLE TX_ESP TX_GPS = Res: Resistor; Published: 8-Jun-2000; LatestRevisionDate: 17-Jul-2002; LatestRevisionNote: Re-released for DXP Platform.; PackageReference: AXIAL-0.3; Publisher: Altium Limited
S?#2 = SW_PB2: as S?#1 on sheet MCU_stm32f407vet6; Mounting Technology: Surface Mount\Through-Hole; ComponentLink1Description: Datasheet; Pin Count: 0; Update Date: 6/3/2012; Category: MISC; HelpURL: http://s3.picofile.com/file/7443264187/Coming_Soon_logo.gif
SIM800 = SIM800L: Publisher: 3DFootprint.ir

## Sheet Sensor.SchDoc
size A; SheetNumber: 5; SheetTotal: 5
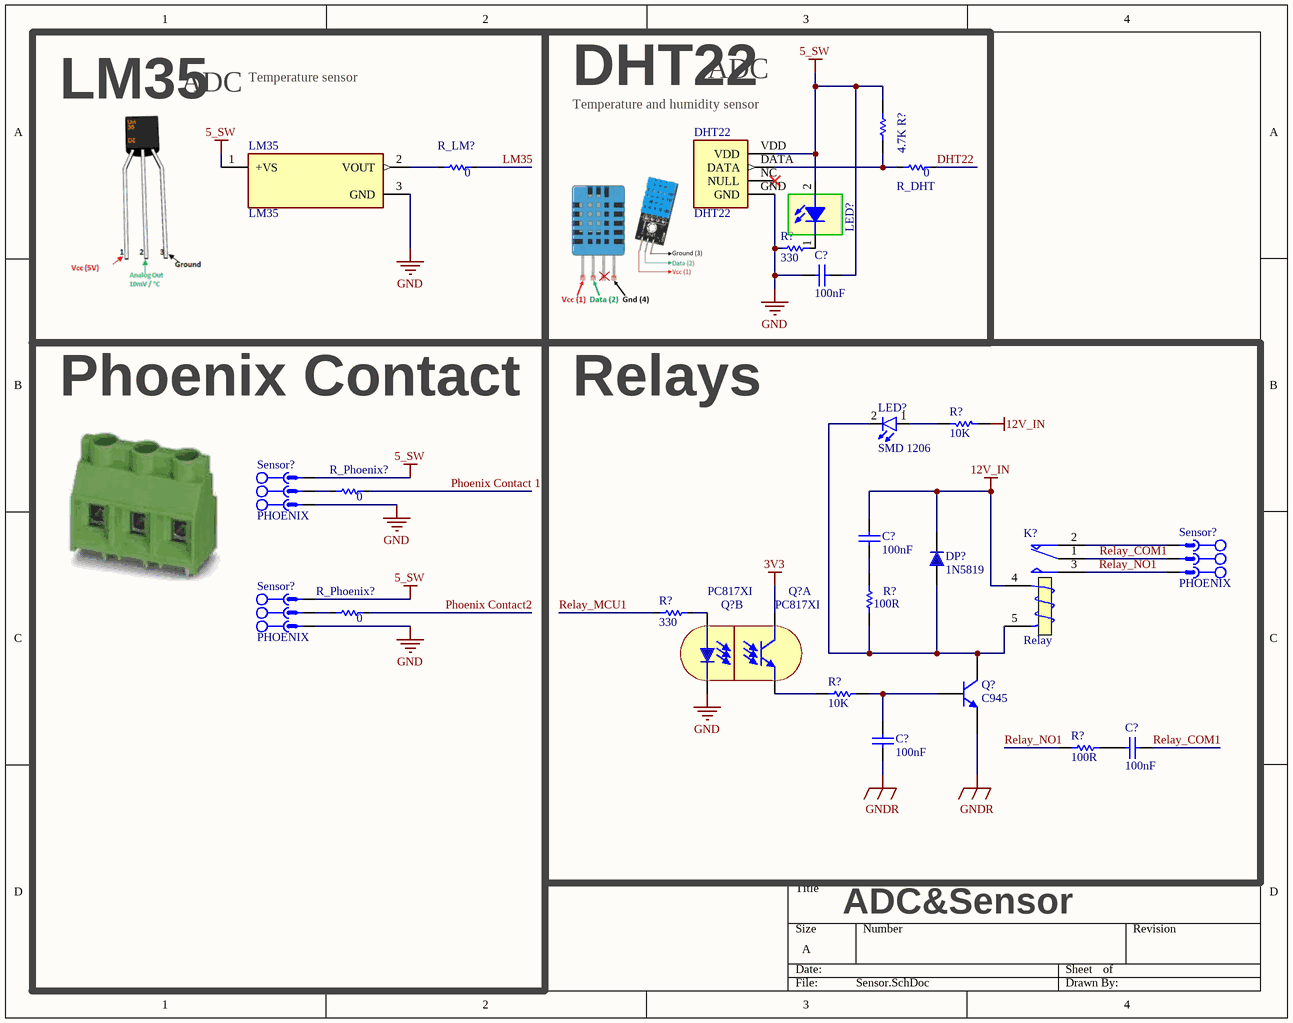
[diagram p4: Sensor.SchDoc]

### Parts
(Parts that share a designator on the sheet are numbered #1, #2 ... from top to bottom, then left to right.)
C?#29  100nF  [MY_CAP_SMD_0603]
C?#30  100nF  [MY_CAP_SMD_0603]
C?#31  100nF  [MY_CAP_SMD_0603]
C?#32  100nF  [MY_CAP_SMD_0603]
DHT22  DHT22  [DHT22]
DP?#3  1N5819  [1n58XX DO-201AD]
K?  Relay  [Relay 15.40x12.10x13.10]
LED?#1  SMD 1206 LED  [LED 1206]  (value not drawn)
LED?#2  Size: SMD 1206  [LED SMD 1206]  (hidden comment: Red)
LM35  LM35  [TO92127P521H735-3]
Q?#2  PC817XI  [SMT Gullwing Lead-Form]  (part B of 2)
Q?#3  PC817XI  [SMT Gullwing Lead-Form]  (part A of 2)
Q?#4  C945  [SOT23_N]
R?#23  4.7K  [RESC3413X04N]
R?#24  330  [0603]
R?#25  10K  [R0603]
R?#26  330  [0603]
R?#27  100R  [RESC3413X04N]
R?#28  10K  [RESC3413X04N]
R?#29  100R  [RESC3413X04N]
R_DHT  0  [0603]
R_LM?  0  [0603]
R_Phoenix?#1  0  [0603]
R_Phoenix?#2  0  [0603]
Sensor?#1  PHOENIX  [MSTB 2,5/3-G-5,08]
Sensor?#2  PHOENIX  [MSTB 2,5/3-G-5,08]
Sensor?#3  PHOENIX  [MSTB 2,5/3-G-5,08]

### Blocks framed on the sheet
LM35: LM35 R_LM?
DHT22: C?#29 DHT22 LED?#1 R?#23 R?#24 R_DHT
Phoenix Contact: R_Phoenix?#1 R_Phoenix?#2 Sensor?#1 Sensor?#3
Relays: C?#30-C?#32 DP?#3 K? LED?#2 Q?#2-Q?#4 R?#25-R?#29 Sensor?#2

### Nets
3V3: Q?#3.4(C)
5_SW: C?#29.2 DHT22.VDD LED?#1.2 LM35.1(+VS) R?#23.2 Sensor?#1.3 Sensor?#3.3
12V_IN: C?#30.2 DP?#3.2 K?.4(T1) R?#25.2
GND: C?#29.1 DHT22.GND LM35.3(GND) Q?#2.2(K) R?#24.1 Sensor?#1.1 Sensor?#3.1
GNDR: C?#31.1 Q?#4.2(E)
DHT22: R_DHT.2
LM35: R_LM?.2
Phoenix Contact2: R_Phoenix?#2.2
Phoenix Contact 1: R_Phoenix?#1.2
Relay_COM1: C?#32.1 K?.1(COM) Sensor?#2.2
Relay_MCU1: R?#26.1
Relay_NO1: K?.3(NO) R?#29.2 Sensor?#2.1
NetC?#30_1: C?#30.1 R?#27.1
NetC?#31_2: C?#31.2 Q?#4.1(B) R?#28.1
NetC?#32_2: C?#32.2 R?#29.1
NetDHT22_DATA: DHT22.DATA R?#23.1 R_DHT.1
NetDP?#3_1: DP?#3.1 K?.5(T2) LED?#2.2(K) Q?#4.3(C) R?#27.2
NetK?_2: K?.2(NC) Sensor?#2.3
NetLED?#1_1: LED?#1.1 R?#24.2
NetLED?#2_1: LED?#2.1(A) R?#25.1
NetLM35_2: LM35.2(VOUT) R_LM?.1
NetQ?#2_1: Q?#2.1(A) R?#26.2
NetQ?#3_3: Q?#3.3(E) R?#28.2
NetR_Phoenix?#1_1: R_Phoenix?#1.1 Sensor?#1.2
NetR_Phoenix?#2_1: R_Phoenix?#2.1 Sensor?#3.2

Not connected (* = marked no-connect by the designer): DHT22 NC(NULL)*

### Notes on the sheet
- ADC
- Temperature sensor
- (near DHT22) Temperature and humidity sensor
- ADC&Sensor

### Library data of the parts
C?#29-C?#32 = CAP SMD_0603: 1.6 mm × 0.8 mm
DHT22 = DHT22: Capacitive-type humidity and temperature module/sensor; MF: Aosong Electronics; SnapEDA_Link: https://www.snapeda.com/parts/DHT22/Aosong+Electronics/view-part/?ref=snap; Package: Package; Value: *; MP: DHT22; Check_prices: https://www.snapeda.com/parts/DHT22/Aosong+Electronics/view-part/?ref=eda
DP?#3 = 1N5819: as DP?#1 on sheet Power; Data: 16-12-2016; Link: *; Part. No: *
K? = RELAY General: Relay_SPDT POWER NEEDLE; Designer: Ali Hafizi; Company: E.P.I.L; Design_Date: 2011/10/31
LED?#1 = LED SMD 1206
LED?#2 = LED: Designer: Eng. Saeid Jorablo; Company: SJ Libraries; ComponentLink1Description: Datasheet; ComponentLink2Description: Reference; Publisher: SJ Unlimited; Mounting Technology: Surface Mount\Through-Hole; Color: Red; HelpURL: http://s3.picofile.com/file/7443264187/Coming_Soon_logo.gif; Status: Unreleased
LM35 = LM35DZ/NOPB: Temperature Sensor Analog, Local 0Â°C ~ 100Â°C 10mV/Â°C TO-92-3; MP: LM35DZ; MF: Texas Instruments; Price: None; Availability: In Stock; Package: E-PKG AXIAL-LEADED-2 ON Semiconductor; Value: *; SnapEDA_Link: https://www.snapeda.com/parts/LM35DZ/Texas+Instruments/view-part/?ref=snap; Purchase-URL: https://pricing.snapeda.com/search/part/LM35DZ/?ref=eda; Check_prices: https://www.snapeda.com/parts/LM35DZ/Texas+Instruments/view-part/?ref=eda
Q?#2 Q?#3 = PC817XI: DIP 4pin General Purpose  Photocoupler; Published: 2017-2-27; DatasheetVersion: 2017-2-27; PackageVersion: 2017-2-27; PackageReference: SMT Gullwing Lead-Form; Publisher: Abbas Basereh; PackageDescription: SOP, 4-Leads, Body 4/65x6/75mm, Pitch 2/54mm, IPC Medium Density designer:abbas basereh; ComponentLink1Description: Manufacturer Link; ComponentLink1URL: http://www.roboeq.ir/files/id/233/name/PC817.pdf/; ComponentLink2Description: DIP 4pin General Purpose
Q?#4 = C945: NPN Silicon Epitaxial Planar Transistor; Published: 2017-2-8; LatestRevisionDate: 2017; LatestRevisionNote: IPC-7351 Footprint Added.; DatasheetVersion: 2017; PackageVersion: 2017-2-8; PackageReference: SOT23; Publisher: Abbas Basereh; PackageDescription: 3-Pin SOT-23 Package 0.95 mm Pitch, 2.3 mm Lead Span; ComponentLink1Description: Manufacturer Link; ComponentLink1URL: http://www.taitroncomponents.com/; ComponentLink2Description: Datasheet; ComponentLink2URL: http://www.taitroncomponents.com/
R?#23 R?#27-R?#29 = RES 0805 0.125W: as R?#1 on sheet MCU_stm32f407vet6; Data: 16-12-2016
R?#24 R?#26 R_DHT R_LM? R_Phoenix?#1 R_Phoenix?#2 = Res: Resistor; Published: 8-Jun-2000; LatestRevisionDate: 17-Jul-2002; LatestRevisionNote: Re-released for DXP Platform.; PackageReference: AXIAL-0.3; Publisher: Altium Limited
R?#25 = Resistor SMD 0603
Sensor?#1-Sensor?#3 = CON_Phoenix_MSTB_03: 3 Pitch: 5.08 mm Color: green Contact surface: Tin Assembly; Manufacturer: PHOENIX CONTACT; Connector type: PCB Terminal Block; designer: ABBAS BASEREH; Max Current: 12 A; Positions: 3; Voltage: 320 V; Category: Connector; ComponentLink1Description: Header, Nominal current: 12 A Rated voltage (III/2): 320 V Number of positions: 3 Pitch: 5.08 mm Color: green Contact surface: Tin Assembly: Soldering  DESIGNER:ABBAS BASEREH; ComponentLink2Description: Reference; Mounting Technology: Through-Hole; Pin Count: 3; Revision 1: 2017-3-1; Status: Unreleased; PART.NO: PHOENIX

## Nets that join several sheets
3V3: MCU_stm32f407vet6 (18 pins), UI (OLED_SSD1306.2), Communication (7 pins), Sensor (Q?#3.4)
5_SW: Power (6 pins), Communication (BLE.4 GPS.4 R?#21.2), Sensor (7 pins)
12V_IN: Power (DC_Power_Jack?.1 DP?#1.2 F?.1), Sensor (C?#30.2 DP?#3.2 K?.4 R?#25.2)
GND: MCU_stm32f407vet6 (24 pins), Power (13 pins), UI (microSD_Module?.1 OLED_SSD1306.1 Q?#1.2), Communication (21 pins), Sensor (7 pins)
DHT22: MCU_stm32f407vet6 (U?#1.36), Sensor (R_DHT.2)
LM35: MCU_stm32f407vet6 (U?#1.35), Sensor (R_LM?.2)
Relay_MCU1: MCU_stm32f407vet6 (U?#1.55), Sensor (R?#26.1)